# Altium schematic sheet UART.SchDoc: UART
size A; DrawnBy: Craig Hesling; Revision: 2
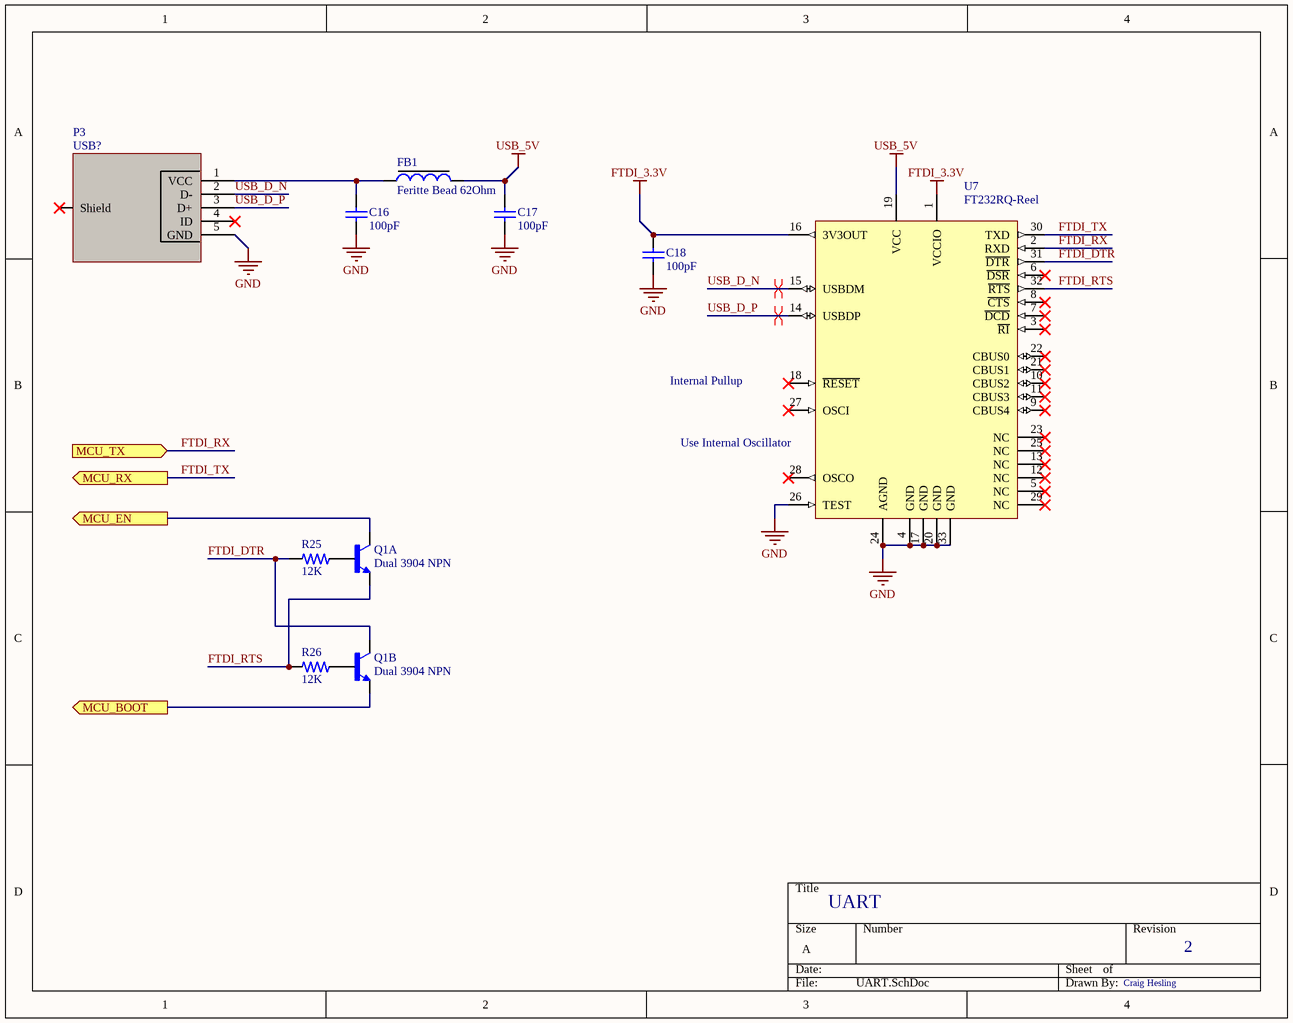
[diagram p0: UART.SchDoc]

## Parts
C16  100pF  [CAPC1608X09L - CAP0603]
C17  100pF  [CAPC1608X09L - CAP0603]
C18  100pF  [CAPC1608X09L - CAP0603]
FB1  Feritte Bead 62Ohm  [INDC1608X10L - FL0603]
P3  USB?  [MicroUSB_TypeB]
Q1  Dual 3904 NPN  [SOT65P210X110-6L]  (parts A,B of 2)
R25  12K  [RESC1608X06L - RES0603]
R26  12K  [RESC1608X06L - RES0603]
U7  FT232RQ-Reel  [PQFN5X5-32_V_FTDI_BIG_VIAS]

## Ports
MCU_BOOT (out), MCU_EN (out), MCU_RX (out), MCU_TX (in)

## Nets
FTDI_3.3V: C18.2 U7.1(VCCIO) U7.16(3V3OUT)
GND: C16.1 C17.1 C18.1 P3.5(GND) U7.4(GND) U7.17(GND) U7.20(GND) U7.24(AGND) U7.26(TEST) U7.33(GND)
USB_5V: C17.2 FB1.2 U7.19(VCC)
FTDI_DTR: Q1.6(C2) R25.2 U7.31(~{DTR})
FTDI_RTS: Q1.4(E1) R26.2 U7.32(~{RTS})
FTDI_RX: U7.2(RXD) ; port MCU_TX
FTDI_TX: U7.30(TXD) ; port MCU_RX
MCU_BOOT: Q1.1(E2) ; port MCU_BOOT
MCU_EN: Q1.3(C1) ; port MCU_EN
USB_D_N: P3.2(D-) U7.15(USBDM)
USB_D_P: P3.3(D+) U7.14(USBDP)
NetC16_2: C16.2 FB1.1 P3.1(VCC)
NetQ1_2: Q1.2(B2) R26.1
NetQ1_5: Q1.5(B1) R25.1

Not connected (* = marked no-connect by the designer): P3 0(Shield)* 4(ID)*; U7 3(~{RI})* 5(NC)* 6(~{DSR})* 7(~{DCD})* 8(~{CTS})* 9(CBUS4)* 10(CBUS2)* 11(CBUS3)* 12(NC)* 13(NC)* 18(~{RESET})* 21(CBUS1)* 22(CBUS0)* 23(NC)* 25(NC)* 27(OSCI)* 28(OSCO)* 29(NC)*

## Layout directives
differential pair: USB_D_N, USB_D_P

## Notes on the sheet
- Internal Pullup
- (near U7) Use Internal Oscillator

## Library data of the parts
C16-C18 = CAP0603 100pF 5% 50V NP0: SMT 0603 Ceramic Capacitor; TempCoeff: NP0; Tolerance: 5%; Voltage: 50V; Value: 100pF; Supplier 1: Digi-Key; Supplier 2: Digi-Key; Supplier Part Number 1: 399-1061-1-ND; Supplier Part Number 2: 490-1427-1-ND
FB1 = FB0603 62Ohm: Impedance at 100MHz: 62Ohms; Supplier 1: Digi-Key; Supplier Part Number 1: 732-6702-1-ND
P3 = MicroUSB TypeB: Micro USB Type B Port; Supplier: http://www.digikey.com/product-detail/en/amphenol-fci/10118192-0001LF/609-4613-2-ND/2785387; Datasheet: http://portal.fciconnect.com/Comergent//fci/drawing/10118192.pdf; Supplier 1: Digi-Key; Supplier Part Number 1: 609-4613-1-ND
Q1 = MBT3904DW1T1G: 3904 Dual NPN Transistor; Supplier 1: Digi-Key; Supplier 2: Mouser; Supplier Part Number 1: MBT3904DW1T1GOSCT-ND; Supplier Part Number 2: 863-SMBT3904DW1T1G
R25 R26 = RES0603 12K 1% 1/10W: SMT 0603 Ceramic Resistor; Power: 1/10W; Tolerance: 1%; Value: 12K; Supplier 1: Digi-Key; Supplier 2: Digi-Key; Supplier Part Number 1: 311-12.0KHRCT-ND; Supplier Part Number 2: RMCF0603FT12K0CT-ND
U7 = FT232RQ-Reel: USB UART Asynchronous Serial Data Transfer Chip, 32-pin QFN, Tape and Reel; Manufacturer: FTDI; DatasheetVersion: ver 2.10, Mar-2012; PackageVersion: Mar-12; PackageReference: PQFN5X5-32; PackageDescription: 32-Pin Quad Flat No-Lead 0.5 mm Pitch, Pullback, 3.2 x 3.2 mm Exposed Pad; PartNumber: FT232RQ-Reel; ComponentLink1Description: Manufacturer URL; ComponentLink1URL: http://www.ftdichip.com/; ComponentLink2Description: Datasheet; ComponentLink2URL: http://www.ftdichip.com/Support/Documents/DataSheets/ICs/DS_FT232R.pdf